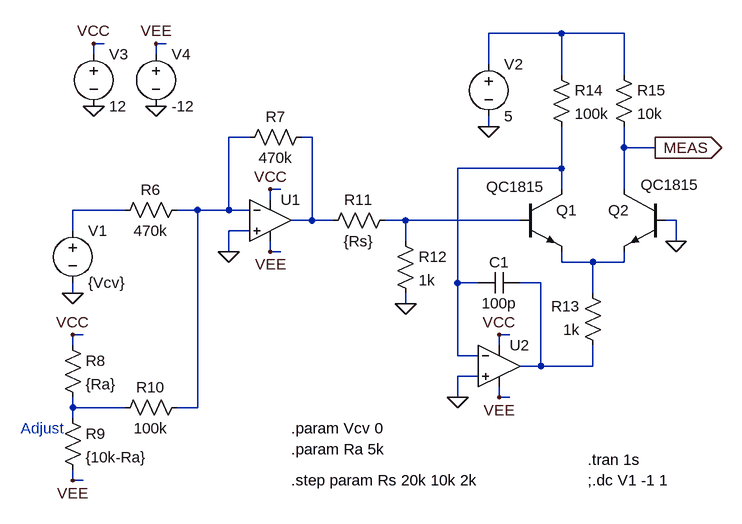
[diagram p0: schematic Antilog_NPNO_PCB_op.asc]
Antilog_NPNO_PCB_op.asc, the LTspice schematic file:
Version 4
SHEET 1 1020 688
WIRE 752 -176 640 -176
WIRE 848 -176 752 -176
WIRE 48 -160 32 -160
WIRE 144 -160 128 -160
WIRE 32 -144 32 -160
WIRE 128 -144 128 -160
WIRE 640 -128 640 -176
WIRE 752 -112 752 -176
WIRE 848 -112 848 -176
WIRE 640 -32 640 -48
WIRE 272 -16 240 -16
WIRE 368 -16 352 -16
WIRE 848 0 848 -32
WIRE 896 0 848 0
WIRE 752 32 752 -32
WIRE 752 32 592 32
WIRE 320 64 304 64
WIRE 752 64 752 32
WIRE 848 64 848 0
WIRE 304 80 304 64
WIRE 80 96 0 96
WIRE 192 96 160 96
WIRE 240 96 240 -16
WIRE 240 96 192 96
WIRE 272 96 240 96
WIRE 368 112 368 -16
WIRE 368 112 336 112
WIRE 400 112 368 112
WIRE 512 112 480 112
WIRE 688 112 512 112
WIRE 928 112 912 112
WIRE 0 128 0 96
WIRE 272 128 240 128
WIRE 512 144 512 112
WIRE 928 144 928 112
WIRE 240 160 240 128
WIRE 304 160 304 144
WIRE 320 160 304 160
WIRE 752 176 752 160
WIRE 800 176 752 176
WIRE 848 176 848 160
WIRE 848 176 800 176
WIRE 592 208 592 32
WIRE 624 208 592 208
WIRE 720 208 688 208
WIRE 0 224 0 208
WIRE 800 224 800 176
WIRE 512 240 512 224
WIRE 16 288 0 288
WIRE 672 288 656 288
WIRE 0 304 0 288
WIRE 656 304 656 288
WIRE 592 320 592 208
WIRE 624 320 592 320
WIRE 720 336 720 208
WIRE 720 336 688 336
WIRE 800 336 800 304
WIRE 800 336 720 336
WIRE 624 352 592 352
WIRE 592 384 592 352
WIRE 656 384 656 368
WIRE 672 384 656 384
WIRE 0 400 0 384
WIRE 80 400 0 400
WIRE 192 400 192 96
WIRE 192 400 160 400
WIRE 0 416 0 400
WIRE 0 512 0 496
WIRE 16 512 0 512
FLAG 0 224 0
FLAG 304 64 VCC
FLAG 304 160 VEE
FLAG 0 288 VCC
FLAG 0 512 VEE
FLAG 656 288 VCC
FLAG 656 384 VEE
FLAG 592 384 0
FLAG 512 240 0
FLAG 928 144 0
FLAG 640 -32 0
FLAG 32 -64 0
FLAG 128 -64 0
FLAG 32 -160 VCC
FLAG 128 -160 VEE
FLAG 240 160 0
FLAG 896 0 MEAS
IOPIN 896 0 Out
DATAFLAG 848 0 ""
DATAFLAG 800 176 ""
DATAFLAG 720 336 ""
DATAFLAG 752 32 ""
DATAFLAG 512 112 ""
DATAFLAG 192 96 ""
SYMBOL voltage 0 112 R0
SYMATTR InstName V1
SYMATTR Value {Vcv}
SYMBOL res 176 80 R90
WINDOW 0 0 56 VBottom 2
WINDOW 3 32 56 VTop 2
SYMATTR InstName R6
SYMATTR Value 470k
SYMBOL Opamps\\UniversalOpamp2 304 112 R0
SYMATTR InstName U1
SYMBOL res 368 -32 R90
WINDOW 0 0 56 VBottom 2
WINDOW 3 32 56 VTop 2
SYMATTR InstName R7
SYMATTR Value 470k
SYMBOL res -16 288 R0
SYMATTR InstName R8
SYMATTR Value {Ra}
SYMBOL res -16 400 R0
SYMATTR InstName R9
SYMATTR Value {10k-Ra}
SYMBOL res 176 384 R90
WINDOW 0 0 56 VBottom 2
WINDOW 3 32 56 VTop 2
SYMATTR InstName R10
SYMATTR Value 100k
SYMBOL res 496 96 R90
WINDOW 0 0 56 VBottom 2
WINDOW 3 32 56 VTop 2
SYMATTR InstName R11
SYMATTR Value {Rs}
SYMBOL Opamps\\UniversalOpamp2 656 336 R0
SYMATTR InstName U2
SYMBOL res 816 320 R180
WINDOW 0 36 76 Left 2
WINDOW 3 36 40 Left 2
SYMATTR InstName R13
SYMATTR Value 1k
SYMBOL cap 688 192 R90
WINDOW 0 0 32 VBottom 2
WINDOW 3 32 32 VTop 2
SYMATTR InstName C1
SYMATTR Value 100p
SYMBOL res 496 128 R0
SYMATTR InstName R12
SYMATTR Value 1k
SYMBOL npn 688 64 R0
WINDOW 3 -52 -4 Left 2
SYMATTR Value QC1815
SYMATTR InstName Q1
SYMBOL npn 912 64 M0
WINDOW 3 -52 -7 Left 2
SYMATTR Value QC1815
SYMATTR InstName Q2
SYMBOL voltage 640 -144 R0
SYMATTR InstName V2
SYMATTR Value 5
SYMBOL res 736 -128 R0
SYMATTR InstName R14
SYMATTR Value 100k
SYMBOL res 832 -128 R0
SYMATTR InstName R15
SYMATTR Value 10k
SYMBOL voltage 32 -160 R0
WINDOW 123 0 0 Left 0
WINDOW 39 0 0 Left 0
SYMATTR InstName V3
SYMATTR Value 12
SYMBOL voltage 128 -160 R0
WINDOW 123 0 0 Left 0
WINDOW 39 0 0 Left 0
SYMATTR InstName V4
SYMATTR Value -12
TEXT -80 432 Left 2 ;Adjust
TEXT 336 464 Left 2 !.param Ra 5k
TEXT 336 432 Left 2 !.param Vcv 0
TEXT 792 480 Left 2 !.tran 1s
TEXT 792 512 Left 2 !;.dc V1 -1 1
TEXT 336 512 Left 2 !.step param Rs 20k 10k 2k

The netlist it stands for:
* Antilog_NPNO_PCB_op.asc
V1 N005 0 {Vcv}
R6 N002 N005 470k
XU1 0 N002 VCC VEE N003 level.2 Avol=1Meg GBW=10Meg Slew=10Meg ilimit=25m rail=0 Vos=0 phimargin=45 en=0 enk=0 in=0 ink=0 Rin=500Meg  ; pins IN+ IN- V+ V- OUT
R7 N003 N002 470k
R8 VCC N009 {Ra}
R9 N009 VEE {10k-Ra}
R10 N002 N009 100k
R11 N006 N003 {Rs}
XU2 0 N004 VCC VEE N008 level.2 Avol=1Meg GBW=10Meg Slew=10Meg ilimit=25m rail=0 Vos=0 phimargin=45 en=0 enk=0 in=0 ink=0 Rin=500Meg  ; pins IN+ IN- V+ V- OUT
R13 N008 N007 1k
C1 N008 N004 100p
R12 N006 0 1k
Q1 N004 N006 N007 0 QC1815
Q2 MEAS 0 N007 0 QC1815
V2 N001 0 5
R14 N001 N004 100k
R15 N001 MEAS 10k
V3 VCC 0 12
V4 VEE 0 -12
.model NPN NPN
.model PNP PNP
.lib standard.bjt
* Adjust
.param Ra 5k
.param Vcv 0
.tran 1s
;.dc V1 -1 1
.step param Rs 20k 10k 2k
.lib UniversalOpamps2.sub
.backanno
.end